# Altium schematic sheet PHY SFC CONN.SchDoc: C-F-U-Bridge
size A3; ApprovedBy: Luca Schenetti; CheckedBy: Luca Schenetti; Author: Luca Schenetti; DrawnBy: Luca Schenetti; Revision: A; SheetNumber: 4; SheetTotal: 7
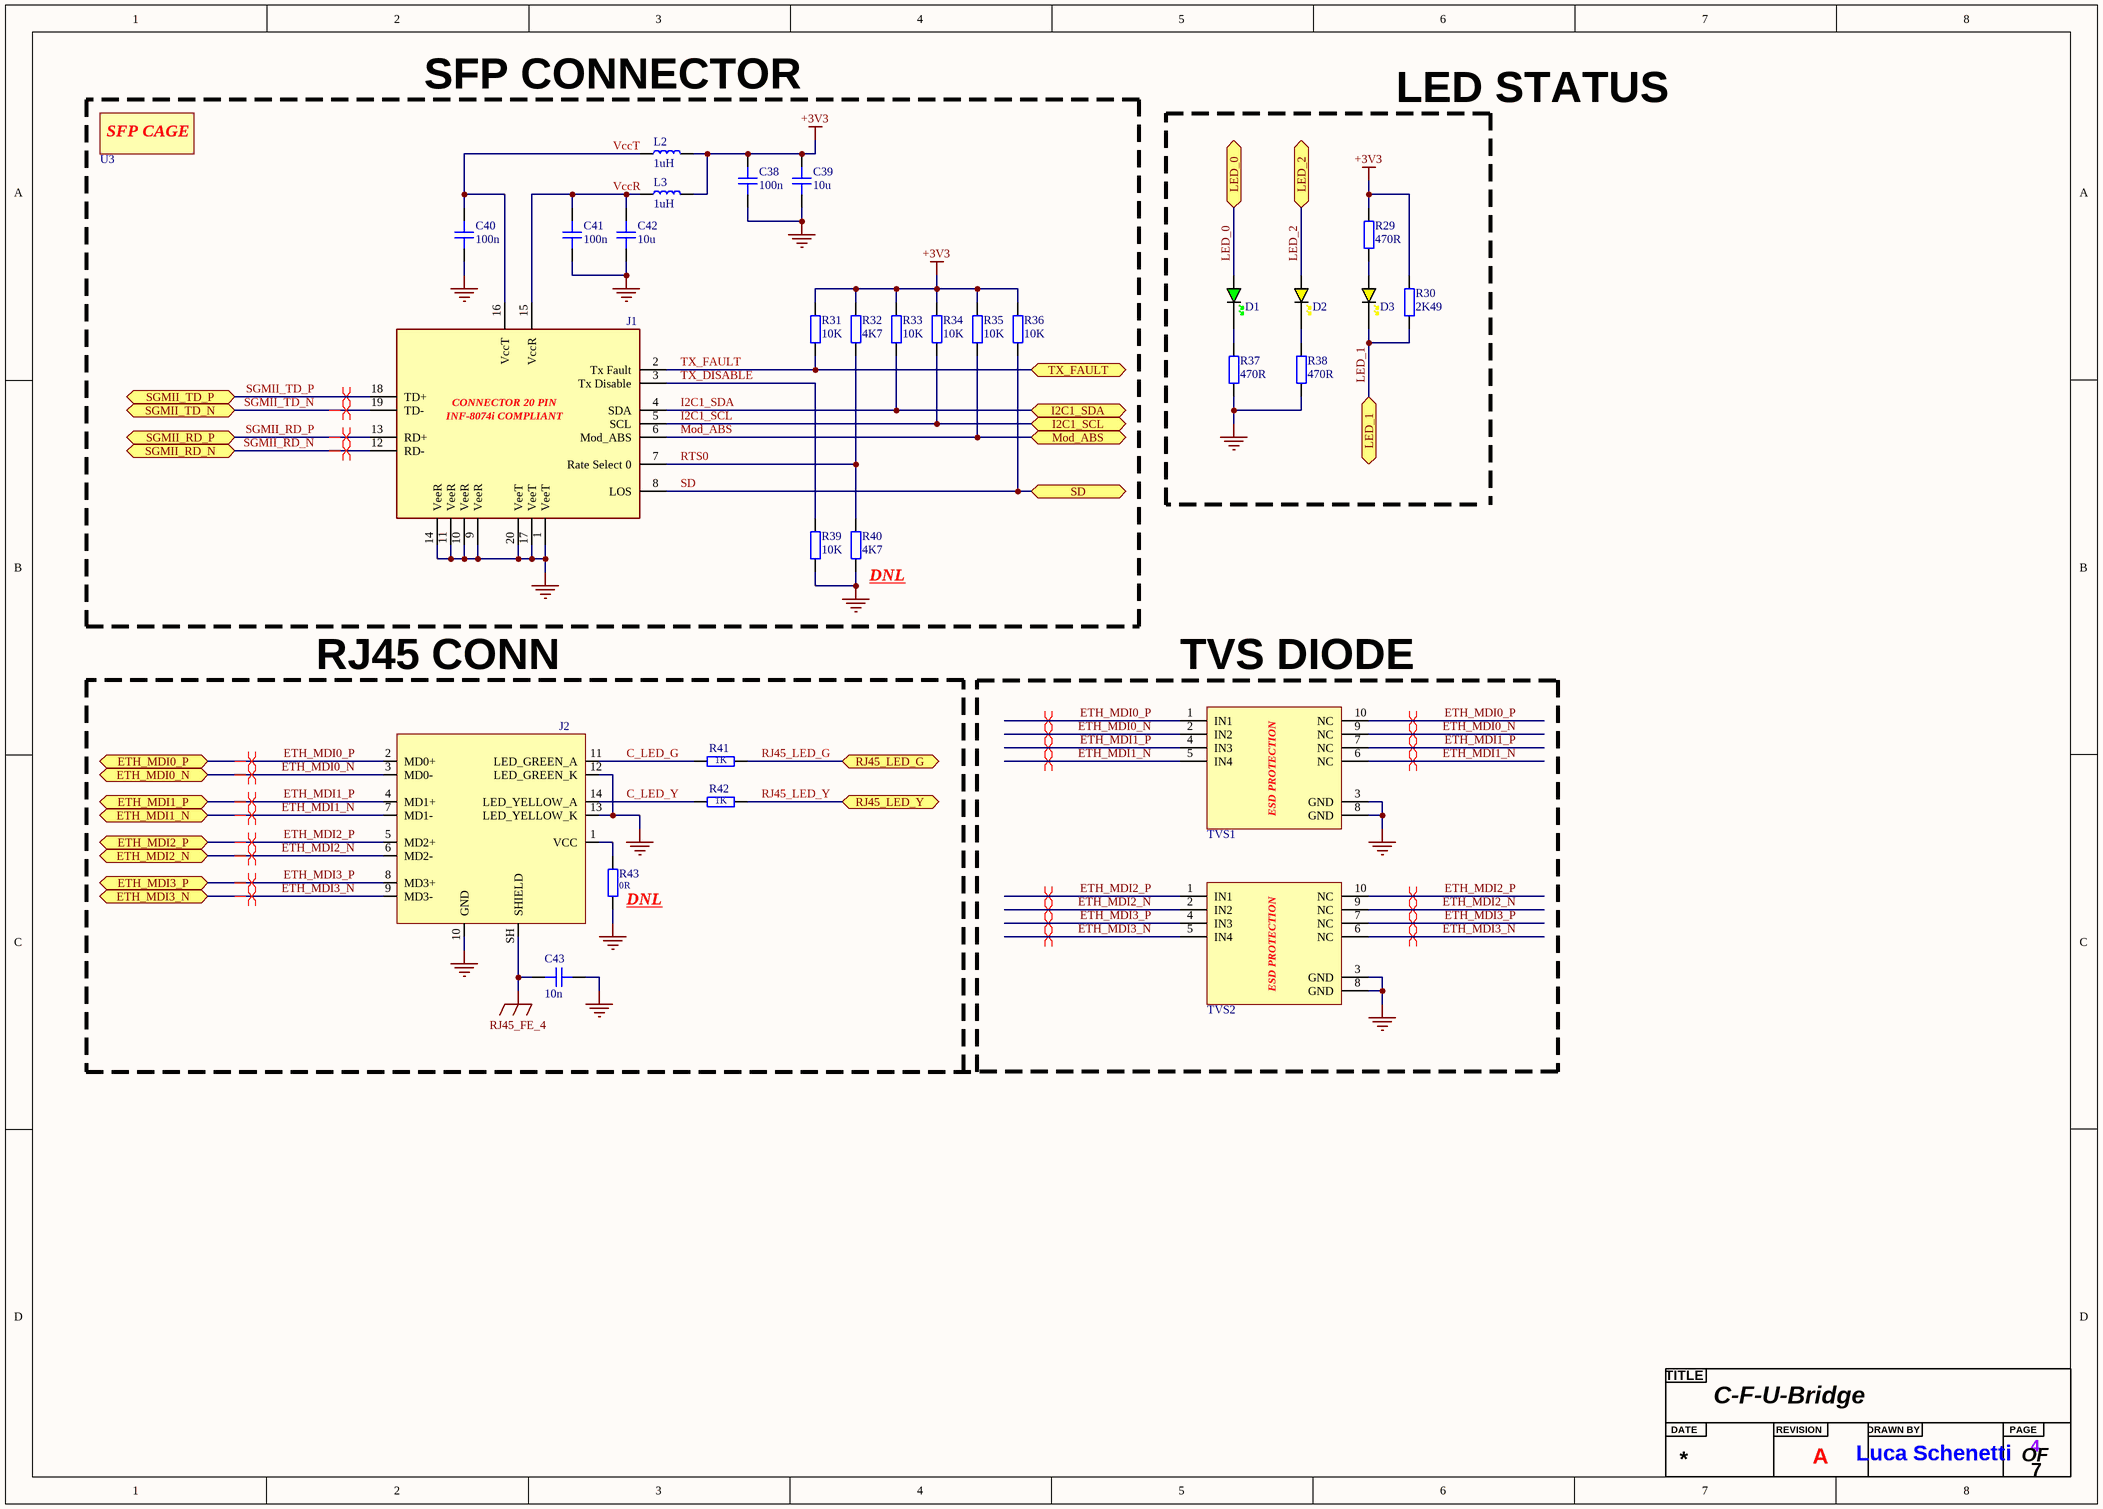
[diagram p0: PHY SFC CONN.SchDoc]

## Parts
?  Title  (value not drawn)  (graphical)
C38  100n  [CAP_0603]
C39  10u  [CAP_0603]
C40  100n  [CAP_0603]
C41  100n  [CAP_0603]
C42  10u  [CAP_0603]
C43  10n  [CAP_1206]
D1  GREEN  [LED_0603_GREEN]  (value not drawn)
D2  YELLOW  [LED_0603_YELLOW]  (value not drawn)
D3  YELLOW  [LED_0603_YELLOW]  (value not drawn)
J1  SHELL 20 PIN FOR SFP CAGE  [1367073-1]  (value not drawn)
J2  100/1000Base-T RJ45 MAGJACK  [HR911130A]  (value not drawn)
L2  1uH  [IND_0603]
L3  1uH  [IND_0603]
R29  470R  [RES_0603]
R30  2K49  [RES_0603]
R31  10K  [RES_0402]
R32  4K7  [RES_0402]
R33  10K  [RES_0402]
R34  10K  [RES_0402]
R35  10K  [RES_0402]
R36  10K  [RES_0402]
R37  470R  [RES_0603]
R38  470R  [RES_0603]
R39  10K  [RES_0402]
R40  4K7  [RES_0402]  (no BOM)
R41  1K  [RES_0603]
R42  1K  [RES_0603]
R43  0R  [RES_0402]  (no BOM)
TVS1  TVS ARRAY  [RClamp0524PATCT]  (value not drawn)
TVS2  TVS ARRAY  [RClamp0524PATCT]  (value not drawn)
U3  SFP-CAGE  [2227023-1]  (value not drawn)

## Blocks framed on the sheet
SFP CONNECTOR: C38-C42 J1 L2 L3 R31-R36 R39 R40 U3

## Ports
ETH_MDI0_N (bidir, see PHY SFC[5C]), ETH_MDI0_P (bidir, see PHY SFC[5B]), ETH_MDI1_N (bidir, see PHY SFC[5C]), ETH_MDI1_P (bidir, see PHY SFC[5C]), ETH_MDI2_N (bidir, see PHY SFC[5C]), ETH_MDI2_P (bidir, see PHY SFC[5C]), ETH_MDI3_N (bidir, see PHY SFC[5C]), ETH_MDI3_P (bidir, see PHY SFC[5C]), I2C1_SCL (bidir, see STM32 MCU[4C]), I2C1_SDA (bidir, see STM32 MCU[4C]), LED_0 (bidir, see PHY SFC[5C]), LED_1 (bidir, see PHY SFC[5C]), LED_2 (bidir, see PHY SFC[5C]), Mod_ABS (bidir, see STM32 MCU[2D]), RJ45_LED_G (bidir, see STM32 MCU[2C]), RJ45_LED_Y (bidir, see STM32 MCU[2C]), SD (bidir, see PHY SFC[3C]), SGMII_RD_N (bidir, see PHY SFC[5B]), SGMII_RD_P (bidir, see PHY SFC[5B]), SGMII_TD_N (bidir, see PHY SFC[5B]), SGMII_TD_P (bidir, see PHY SFC[5B]), TX_FAULT (bidir, see STM32 MCU[4C])

## Nets
+3V3: C38.2 C39.2 L2.1 L3.1 R29.2 R30.2 R31.2 R32.2 R33.2 R34.2 R35.2 R36.2
GND: C38.1 C39.1 C40.1 C41.1 C42.1 C43.2 J1.1(VeeT) J1.9(VeeR) J1.10(VeeR) J1.11(VeeR) J1.14(VeeR) J1.17(VeeT) J1.20(VeeT) J2.10(GND) J2.12(LED_GREEN_K) J2.13(LED_YELLOW_K) R37.1 R38.1 R39.1 R40.1 R43.1 TVS1.3(GND) TVS1.8(GND) TVS2.3(GND) TVS2.8(GND)
RJ45_FE_4: C43.1 J2.SH(SHIELD)
C_LED_G: J2.11(LED_GREEN_A) R41.2
C_LED_Y: J2.14(LED_YELLOW_A) R42.2
ETH_MDI0_N: J2.3(MD0-) TVS1.2(IN2) TVS1.9(NC) ; port ETH_MDI0_N
ETH_MDI0_P: J2.2(MD0+) TVS1.1(IN1) TVS1.10(NC) ; port ETH_MDI0_P
ETH_MDI1_N: J2.7(MD1-) TVS1.5(IN4) TVS1.6(NC) ; port ETH_MDI1_N
ETH_MDI1_P: J2.4(MD1+) TVS1.4(IN3) TVS1.7(NC) ; port ETH_MDI1_P
ETH_MDI2_N: J2.6(MD2-) TVS2.2(IN2) TVS2.9(NC) ; port ETH_MDI2_N
ETH_MDI2_P: J2.5(MD2+) TVS2.1(IN1) TVS2.10(NC) ; port ETH_MDI2_P
ETH_MDI3_N: J2.9(MD3-) TVS2.5(IN4) TVS2.6(NC) ; port ETH_MDI3_N
ETH_MDI3_P: J2.8(MD3+) TVS2.4(IN3) TVS2.7(NC) ; port ETH_MDI3_P
I2C1_SCL: J1.5(SCL) R34.1 ; port I2C1_SCL
I2C1_SDA: J1.4(SDA) R33.1 ; port I2C1_SDA
LED_0: D1.A ; port LED_0
LED_1: D3.K R30.1 ; port LED_1
LED_2: D2.A ; port LED_2
Mod_ABS: J1.6(Mod_ABS) R35.1 ; port Mod_ABS
RJ45_LED_G: R41.1 ; port RJ45_LED_G
RJ45_LED_Y: R42.1 ; port RJ45_LED_Y
RTS0: J1.7(Rate_Select_0) R32.1 R40.2
SD: J1.8(LOS) R36.1 ; port SD
SGMII_RD_N: J1.12(RD-) ; port SGMII_RD_N
SGMII_RD_P: J1.13(RD+) ; port SGMII_RD_P
SGMII_TD_N: J1.19(TD-) ; port SGMII_TD_N
SGMII_TD_P: J1.18(TD+) ; port SGMII_TD_P
TX_DISABLE: J1.3(Tx_Disable) R39.2
TX_FAULT: J1.2(Tx_Fault) R31.1 ; port TX_FAULT
VccR: C41.2 C42.2 J1.15(VccR) L3.2
VccT: C40.2 J1.16(VccT) L2.2
NetD1_K: D1.K R37.2
NetD2_K: D2.K R38.2
NetD3_A: D3.A R29.1
NetJ2_1: J2.1(VCC) R43.2

## Layout directives
differential pair; differential pair class DIFF_SGMII_100Ω; rule Matched Net Lengths [Delay Tolerance = 15ps]: SGMII_RD_N, SGMII_RD_P, SGMII_TD_N, SGMII_TD_P
differential pair; differential pair class DIFF_MDI_100Ω: ETH_MDI0_N, ETH_MDI0_P, ETH_MDI1_N, ETH_MDI1_P, ETH_MDI2_N, ETH_MDI2_P, ETH_MDI3_N, ETH_MDI3_P
differential pair; differential pair class DIFF_MDI_100Ω; rule Matched Net Lengths [Delay Tolerance = 50ps]: ETH_MDI0_N, ETH_MDI0_P, ETH_MDI1_N, ETH_MDI1_P, ETH_MDI2_N, ETH_MDI2_P, ETH_MDI3_N, ETH_MDI3_P

## Notes on the sheet
- LED STATUS
- (near R40) DNL
- RJ45 CONN
- (near TVS1) TVS DIODE
- (near R43) DNL
- (in symbol 1367073-1) CONNECTOR 20 PIN; INF‑8074i COMPLIANT
- (in symbol 2227023-1) SFP CAGE
- (in symbol RClamp0524PATCT) ESD PROTECTION
- (in symbol Title) TITLE; DATE; REVISION; DRAWN BY; PAGE; OF

## Library data of the parts
C38 C40 C41 = CAP_0603: [C14663]; Manufacturer: *; Manufacturer Part Number: *; Distributor Link: *; LCSC: *; Rating: *; Dielectric: *
C39 C42 = CAP_0603: [C19702]; Manufacturer: *; Manufacturer Part Number: *; Distributor Link: *; LCSC: *; Rating: *; Dielectric: *
C43 = CAP_1206: [C1846]; Manufacturer: *; Manufacturer Part Number: *; Distributor Link: *; LCSC: *; Rating: *; Dielectric: *
D1 = LED_0603_GREEN: [C2986059]
D2 D3 = LED_0603_YELLOW: [C84269]
J1 = 1367073-1: [C210158]
J2 = HR911130A: [C54408]; Manufacturer: Hanrun; Manufacturer Part Number: HR911130A
L2 L3 = IND_0603: [C383366]
R29 R37 R38 = RES_0603: [C23179]; Manufacturer: *; Manufacturer Part Number: *; Distributor Link: *; LCSC: *
R30 = RES_0603: [C22908]; Manufacturer: *; Manufacturer Part Number: *; Distributor Link: *; LCSC: *
R31 R33-R36 R39 = RES_0402: [C25744]; Manufacturer: *; Manufacturer Part Number: *; Distributor Link: *; LCSC: *
R32 = RES_0402: [C23162]; Manufacturer: *; Manufacturer Part Number: *; Distributor Link: *; LCSC: *
R40 = RES_0402: Manufacturer: *; Manufacturer Part Number: *; Distributor Link: *; LCSC: *
R41 R42 = RES_0603: [C21190]; Manufacturer: *; Manufacturer Part Number: *; Distributor Link: *; LCSC: *
R43 = RES_0402: Resistor SMD 0402; Manufacturer: *; Manufacturer Part Number: *; Distributor Link: *; LCSC: *
TVS1 TVS2 = RClamp0524PATCT: [C40960]
U3 = 2227023-1: [C589693]